# Altium schematic sheet SFR_PORTS.SchDoc: LiveDesign Evaluation - EvalBoard Tester
size A3; Organization: Altium Limited; Address1: L3, 12a Rodborough Rd; Address2: Frenchs Forest; Address3: NSW; Address4: Australia 2086; DocumentNumber: 6; SheetNumber: 6; SheetTotal: 16
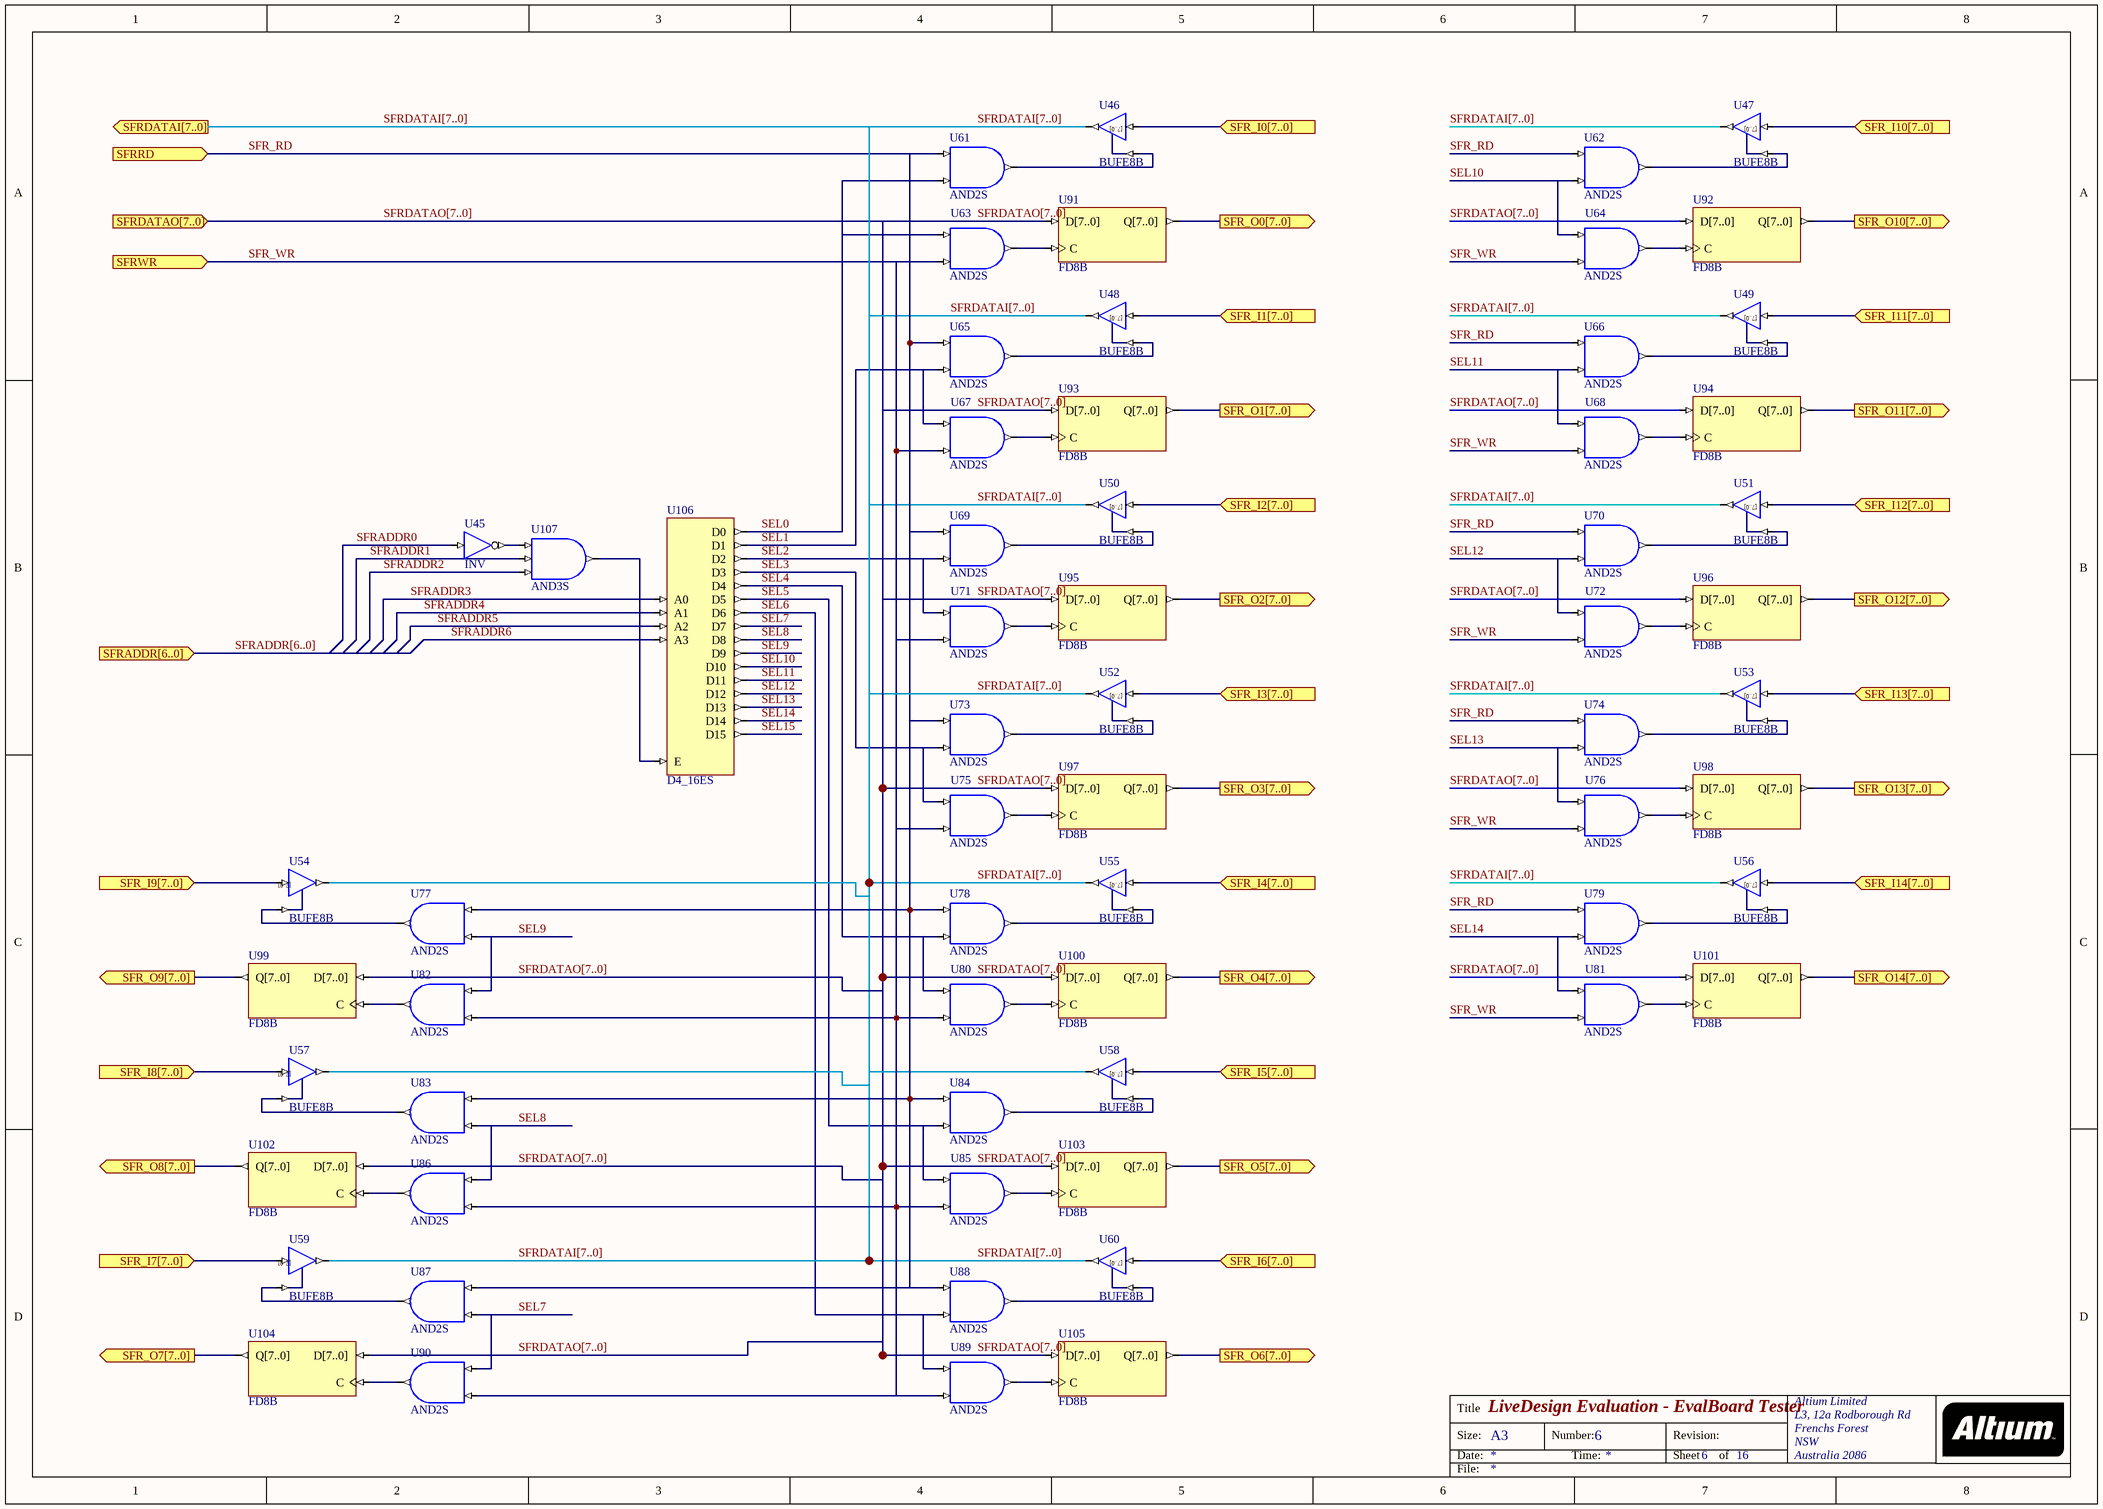
[diagram p0: SFR_PORTS.SchDoc]

## Parts
U45  INV
U46  BUFE8B
U47  BUFE8B
U48  BUFE8B
U49  BUFE8B
U50  BUFE8B
U51  BUFE8B
U52  BUFE8B
U53  BUFE8B
U54  BUFE8B
U55  BUFE8B
U56  BUFE8B
U57  BUFE8B
U58  BUFE8B
U59  BUFE8B
U60  BUFE8B
U61  AND2S
U62  AND2S
U63  AND2S
U64  AND2S
U65  AND2S
U66  AND2S
U67  AND2S
U68  AND2S
U69  AND2S
U70  AND2S
U71  AND2S
U72  AND2S
U73  AND2S
U74  AND2S
U75  AND2S
U76  AND2S
U77  AND2S
U78  AND2S
U79  AND2S
U80  AND2S
U81  AND2S
U82  AND2S
U83  AND2S
U84  AND2S
U85  AND2S
U86  AND2S
U87  AND2S
U88  AND2S
U89  AND2S
U90  AND2S
U91  FD8B
U92  FD8B
U93  FD8B
U94  FD8B
U95  FD8B
U96  FD8B
U97  FD8B
U98  FD8B
U99  FD8B
U100  FD8B
U101  FD8B
U102  FD8B
U103  FD8B
U104  FD8B
U105  FD8B
U106  D4_16ES
U107  AND3S

## Ports
SFR_I0[7..0] (in), SFR_I1[7..0] (in), SFR_I2[7..0] (in), SFR_I3[7..0] (in), SFR_I4[7..0] (in), SFR_I5[7..0] (in), SFR_I6[7..0] (in), SFR_I7[7..0] (in), SFR_I8[7..0] (in), SFR_I9[7..0] (in), SFR_I10[7..0] (in), SFR_I11[7..0] (in), SFR_I12[7..0] (in), SFR_I13[7..0] (in), SFR_I14[7..0] (in), SFR_O0[7..0] (out), SFR_O1[7..0] (out), SFR_O2[7..0] (out), SFR_O3[7..0] (out), SFR_O4[7..0] (out), SFR_O5[7..0] (out), SFR_O6[7..0] (out), SFR_O7[7..0] (out), SFR_O8[7..0] (out), SFR_O9[7..0] (out), SFR_O10[7..0] (out), SFR_O11[7..0] (out), SFR_O12[7..0] (out), SFR_O13[7..0] (out), SFR_O14[7..0] (out), SFRADDR[6..0] (in), SFRDATAI[7..0] (out), SFRDATAO[7..0] (in), SFRRD (in), SFRWR (in)

## Nets
SEL0: U61.I1 U63.I0 U106.D0
SEL1: U65.I1 U67.I0 U106.D1
SEL2: U69.I1 U71.I0 U106.D2
SEL3: U73.I1 U75.I0 U106.D3
SEL4: U78.I1 U80.I0 U106.D4
SEL5: U84.I1 U85.I0 U106.D5
SEL6: U88.I1 U89.I0 U106.D6
SEL7: U87.I1 U90.I0 U106.D7
SEL8: U83.I1 U86.I0 U106.D8
SEL9: U77.I1 U82.I0 U106.D9
SEL10: U62.I1 U64.I0 U106.D10
SEL11: U66.I1 U68.I0 U106.D11
SEL12: U70.I1 U72.I0 U106.D12
SEL13: U74.I1 U76.I0 U106.D13
SEL14: U79.I1 U81.I0 U106.D14
SEL15: U106.D15
SFR_I0[7..0]: U46.I[7..0] ; port SFR_I0[7..0]
SFR_I1[7..0]: U48.I[7..0] ; port SFR_I1[7..0]
SFR_I2[7..0]: U50.I[7..0] ; port SFR_I2[7..0]
SFR_I3[7..0]: U52.I[7..0] ; port SFR_I3[7..0]
SFR_I4[7..0]: U55.I[7..0] ; port SFR_I4[7..0]
SFR_I5[7..0]: U58.I[7..0] ; port SFR_I5[7..0]
SFR_I6[7..0]: U60.I[7..0] ; port SFR_I6[7..0]
SFR_I7[7..0]: U59.I[7..0] ; port SFR_I7[7..0]
SFR_I8[7..0]: U57.I[7..0] ; port SFR_I8[7..0]
SFR_I9[7..0]: U54.I[7..0] ; port SFR_I9[7..0]
SFR_I10[7..0]: U47.I[7..0] ; port SFR_I10[7..0]
SFR_I11[7..0]: U49.I[7..0] ; port SFR_I11[7..0]
SFR_I12[7..0]: U51.I[7..0] ; port SFR_I12[7..0]
SFR_I13[7..0]: U53.I[7..0] ; port SFR_I13[7..0]
SFR_I14[7..0]: U56.I[7..0] ; port SFR_I14[7..0]
SFR_O0[7..0]: U91.Q[7..0] ; port SFR_O0[7..0]
SFR_O1[7..0]: U93.Q[7..0] ; port SFR_O1[7..0]
SFR_O2[7..0]: U95.Q[7..0] ; port SFR_O2[7..0]
SFR_O3[7..0]: U97.Q[7..0] ; port SFR_O3[7..0]
SFR_O4[7..0]: U100.Q[7..0] ; port SFR_O4[7..0]
SFR_O5[7..0]: U103.Q[7..0] ; port SFR_O5[7..0]
SFR_O6[7..0]: U105.Q[7..0] ; port SFR_O6[7..0]
SFR_O7[7..0]: U104.Q[7..0] ; port SFR_O7[7..0]
SFR_O8[7..0]: U102.Q[7..0] ; port SFR_O8[7..0]
SFR_O9[7..0]: U99.Q[7..0] ; port SFR_O9[7..0]
SFR_O10[7..0]: U92.Q[7..0] ; port SFR_O10[7..0]
SFR_O11[7..0]: U94.Q[7..0] ; port SFR_O11[7..0]
SFR_O12[7..0]: U96.Q[7..0] ; port SFR_O12[7..0]
SFR_O13[7..0]: U98.Q[7..0] ; port SFR_O13[7..0]
SFR_O14[7..0]: U101.Q[7..0] ; port SFR_O14[7..0]
SFR_RD: U61.I0 U62.I0 U65.I0 U66.I0 U69.I0 U70.I0 U73.I0 U74.I0 U77.I0 U78.I0 U79.I0 U83.I0 U84.I0 U87.I0 U88.I0 ; port SFRRD
SFR_WR: U63.I1 U64.I1 U67.I1 U68.I1 U71.I1 U72.I1 U75.I1 U76.I1 U80.I1 U81.I1 U82.I1 U85.I1 U86.I1 U89.I1 U90.I1 ; port SFRWR
SFRADDR0: U45.I
SFRADDR1: U107.I1
SFRADDR2: U107.I2
SFRADDR3: U106.A0
SFRADDR4: U106.A1
SFRADDR5: U106.A2
SFRADDR6: U106.A3
SFRDATAI[7..0]: U46.O[7..0] U47.O[7..0] U48.O[7..0] U49.O[7..0] U50.O[7..0] U51.O[7..0] U52.O[7..0] U53.O[7..0] U54.O[7..0] U55.O[7..0] U56.O[7..0] U57.O[7..0] U58.O[7..0] U59.O[7..0] U60.O[7..0] ; port SFRDATAI[7..0]
SFRDATAO[7..0]: U91.D[7..0] U92.D[7..0] U93.D[7..0] U94.D[7..0] U95.D[7..0] U96.D[7..0] U97.D[7..0] U98.D[7..0] U99.D[7..0] U100.D[7..0] U101.D[7..0] U102.D[7..0] U103.D[7..0] U104.D[7..0] U105.D[7..0] ; port SFRDATAO[7..0]
NetU45_O: U45.O U107.I0
NetU46_E: U46.E U61.O
NetU47_E: U47.E U62.O
NetU48_E: U48.E U65.O
NetU49_E: U49.E U66.O
NetU50_E: U50.E U69.O
NetU51_E: U51.E U70.O
NetU52_E: U52.E U73.O
NetU53_E: U53.E U74.O
NetU54_E: U54.E U77.O
NetU55_E: U55.E U78.O
NetU56_E: U56.E U79.O
NetU57_E: U57.E U83.O
NetU58_E: U58.E U84.O
NetU59_E: U59.E U87.O
NetU60_E: U60.E U88.O
NetU63_O: U63.O U91.C
NetU64_O: U64.O U92.C
NetU67_O: U67.O U93.C
NetU68_O: U68.O U94.C
NetU71_O: U71.O U95.C
NetU72_O: U72.O U96.C
NetU75_O: U75.O U97.C
NetU76_O: U76.O U98.C
NetU80_O: U80.O U100.C
NetU81_O: U81.O U101.C
NetU82_O: U82.O U99.C
NetU85_O: U85.O U103.C
NetU86_O: U86.O U102.C
NetU89_O: U89.O U105.C
NetU90_O: U90.O U104.C
NetU106_E: U106.E U107.O

## Buses and harness runs
bus SFRADDR[6..0] = port SFRADDR[6..0]
bus SFRDATAI[7..0]
bus SFRDATAI[7..0] = port SFRDATAI[7..0]
bus SFRDATAO[7..0]
bus SFRDATAO[7..0] = port SFRDATAO[7..0]

## Notes on the sheet
- Title
- Size:
- Date:
- A3
- Number:
- Time:
- Revision:
- Sheet
- of
- File:
- (in symbol BUFE8B) [7..0]

## Library data of the parts
U45 = INV: Inverter; ArchiveName: GENERIC; VHDLIB_SIM: GENERIC_LIB; Published: 29-Jan-2004; Publisher: Altium Limited; Xilinx Equivalent: INV; Core Revision: 1.00.00
U46-U60 = BUFE8B: 8-Bit 3-state Buffer with Active High Enable, Bus Version; Xilinx Equivalent: BUFE8; ArchiveName: GENERIC; VHDLIB_SIM: GENERIC_LIB; Published: 29-Jan-2004; Publisher: Altium Limited; Core Revision: 1.00.00
U61-U90 = AND2S: 2-Input AND Gate, Single Pin Version; Xilinx Equivalent: AND2; ArchiveName: GENERIC; VHDLIB_SIM: GENERIC_LIB; Published: 29-Jan-2004; Publisher: Altium Limited; Core Revision: 1.00.00
U91-U105 = FD8B: 8-Bit D-Type Flip-Flop, Bus Version; Xilinx Equivalent: FD8; ArchiveName: GENERIC; VHDLIB_SIM: GENERIC_LIB; Published: 29-Jan-2004; Publisher: Altium Limited; Core Revision: 1.00.00
U106 = D4_16ES: Binary 4- to 16-Bit Decoder with Enable, Single Pin Version; Xilinx Equivalent: D4_16E; ArchiveName: GENERIC; VHDLIB_SIM: GENERIC_LIB; Published: 29-Jan-2004; Publisher: Altium Limited; Core Revision: 1.00.00
U107 = AND3S: 3-Input AND Gate, Single Pin Version; Xilinx Equivalent: AND3; ArchiveName: GENERIC; VHDLIB_SIM: GENERIC_LIB; Published: 29-Jan-2004; Publisher: Altium Limited; Core Revision: 1.00.00